# EasyEDA Pro project Arduino.eprj

# Schematic Ardunio nano
Create Date: 2023-09-14; Page Name: P1; Project Name: Arduino; Schematic Name: Ardunio nano; Update Date: 2023-09-15; Company: Joshua Ifeanyi Okonkwo; Drawed: EasyEDA Pro; Page Size: A4; Part Number: JLCPCB-002; Reviewed: EasyEDA Pro; Version: V0.1
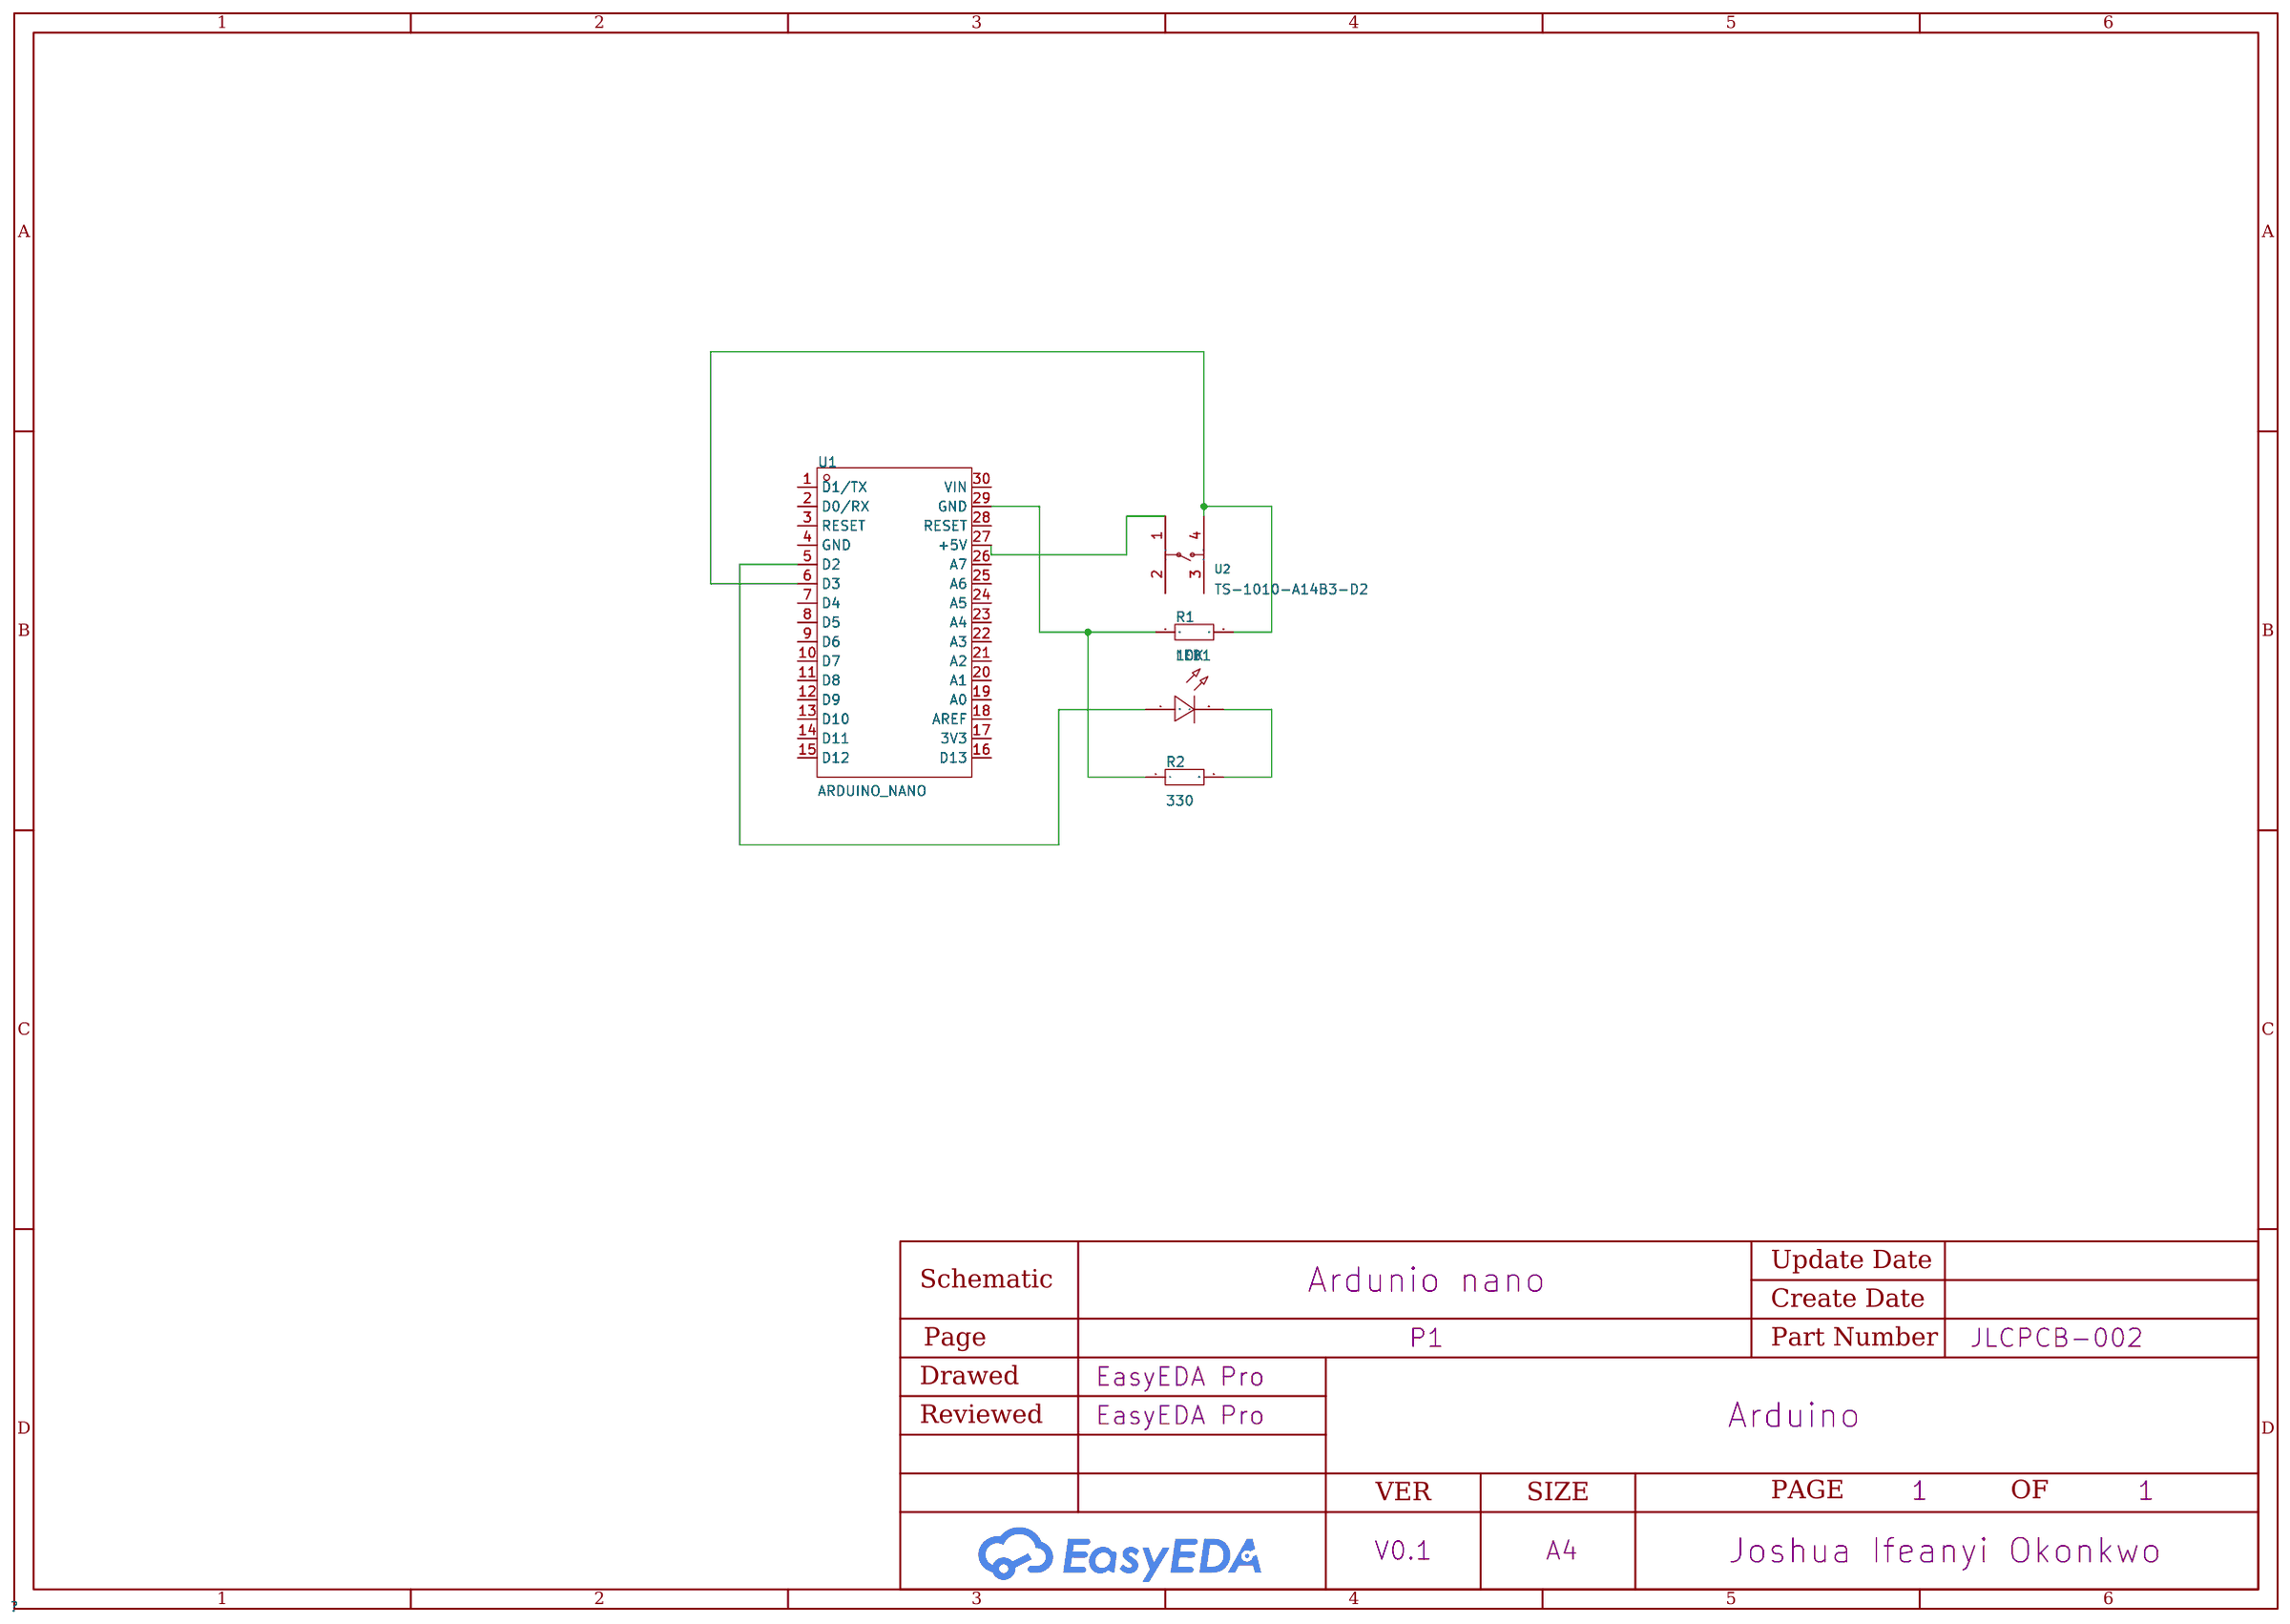
[diagram p0: schematic sheet]

## Parts
LED1  -  [LED-TH_BD3.0-P2.54-FD]
R1  10K  [R0603]
R2  330  [R0603]
U1  ARDUINO_NANO  [COMM-TH_ARDUINO_NANO]
U2  TS-1010-A14B3-D2  [SW-TH_4P-L6.2-W6.2-P4.50-LS6.5]

## Library data of the parts
LED1 = LED_TH-R_3mm: Supplier Footprint: Through
R1 R2 = Res_0603: Supplier Footprint: 0603
U1 = ARDUINO_NANO: Supplier Part: C9900017879; Supplier Footprint: 插件; JLCPCB Part Class: Extended Part; Datasheet: https://atta.szlcsc.comnull; Supplier: LCSC
U2 = TS-1010-A14B3-D2: LCSC Part Name: 防水插件轻触开关6.2*6.2*11四脚插件6*6*11插件IP67按键250gf; Supplier Part: C585183; Manufacturer: Yuandi(元迪); Supplier Footprint: 插件,6.2x6.2mm; JLCPCB Part Class: Extended Part; Datasheet: https://atta.szlcsc.com/upload/public/pdf/source/20230412/8C4FF65CF1BB4088A9FBFCD80E83B7A4.pdf; Supplier: LCSC

## Nets
$1N1786: U1.27(+5V) U2.1
$1N1790: R1.2 U1.6(D3) U2.4
$1N1825: LED1.1(C) U1.5(D2)
$1N1840: LED1.2(A) R2.2
$1N1849: R1.1 R2.1 U1.29(GND)

Not connected (* = marked no-connect by the designer): U1 1(D1/TX) 2(D0/RX) 3(RESET) 4(GND) 7(D4) 8(D5) 9(D6) 10(D7) 11(D8) 12(D9) 13(D10) 14(D11) 15(D12) 16(D13) 17(3V3) 18(AREF) 19(A0) 20(A1) 21(A2) 22(A3) 23(A4) 24(A5) 25(A6) 26(A7) 28(RESET) 30(VIN); U2 2 3

# Board PCB1
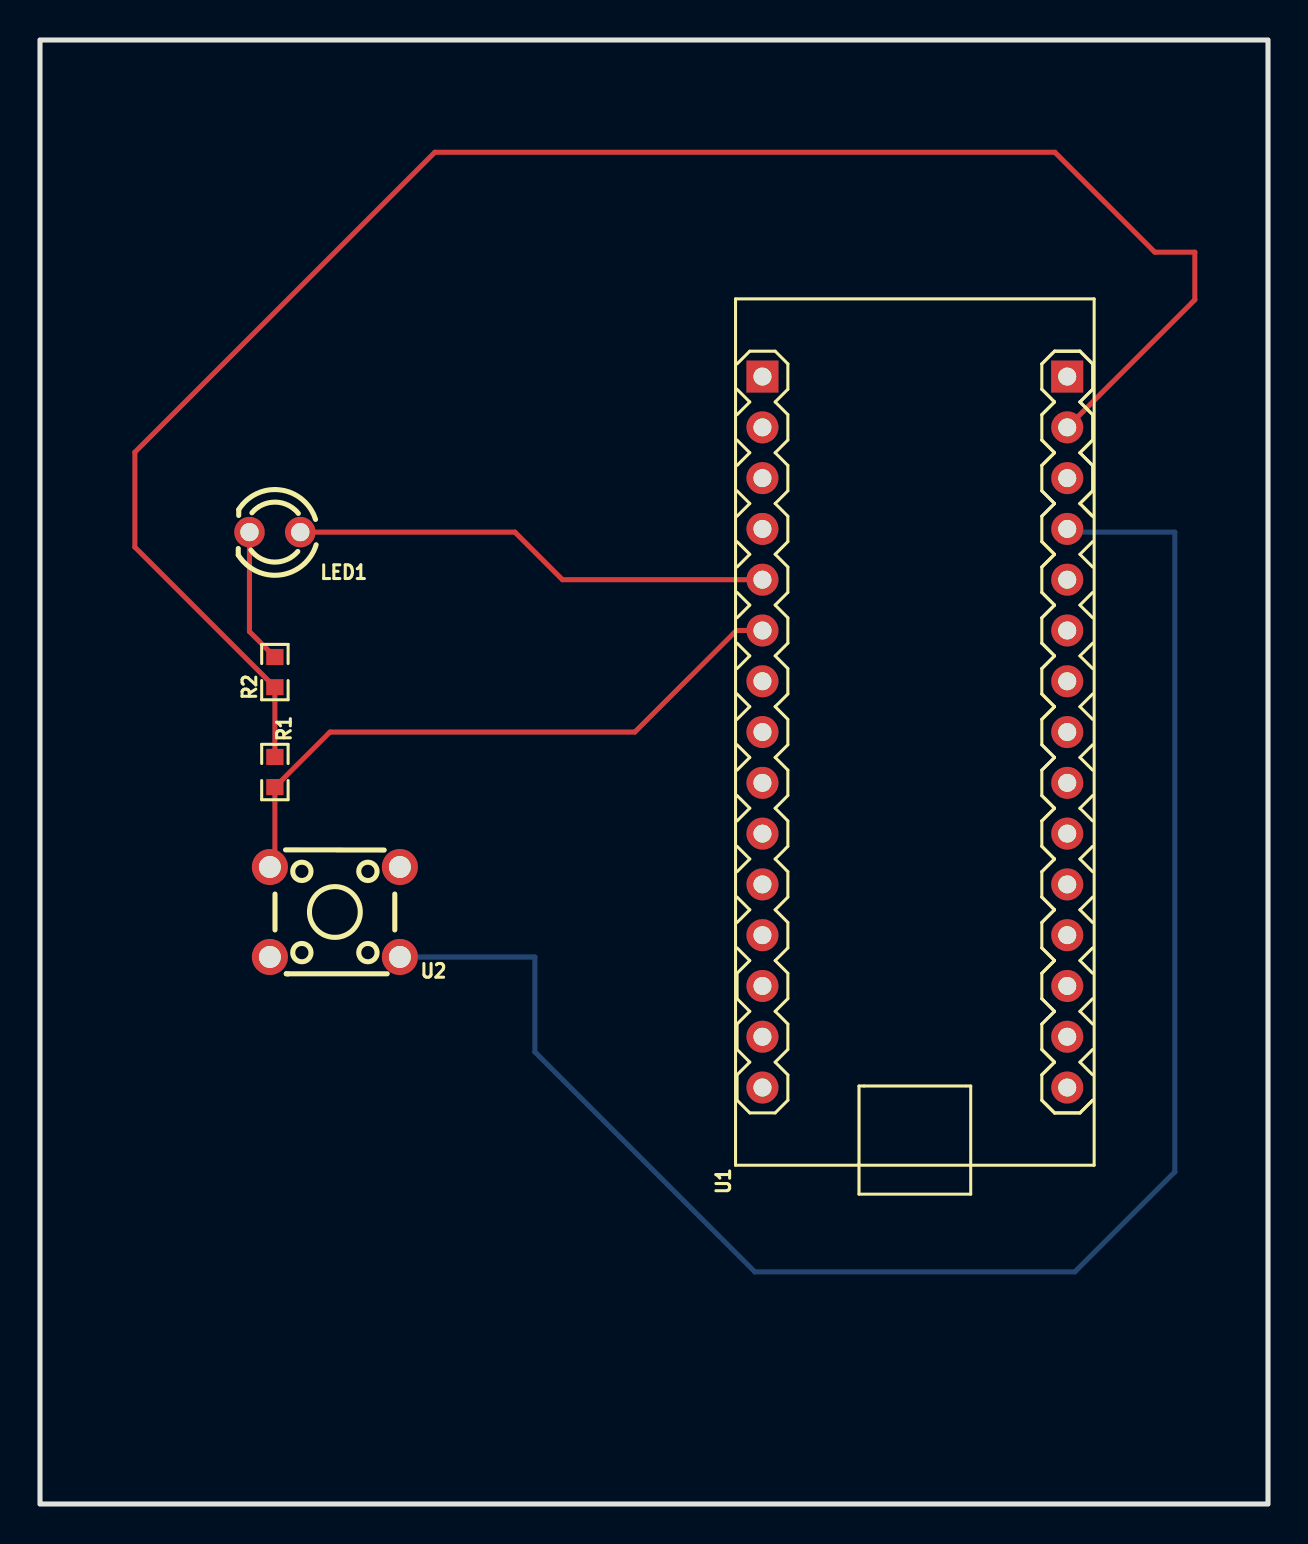
[diagram p1: board, top side]
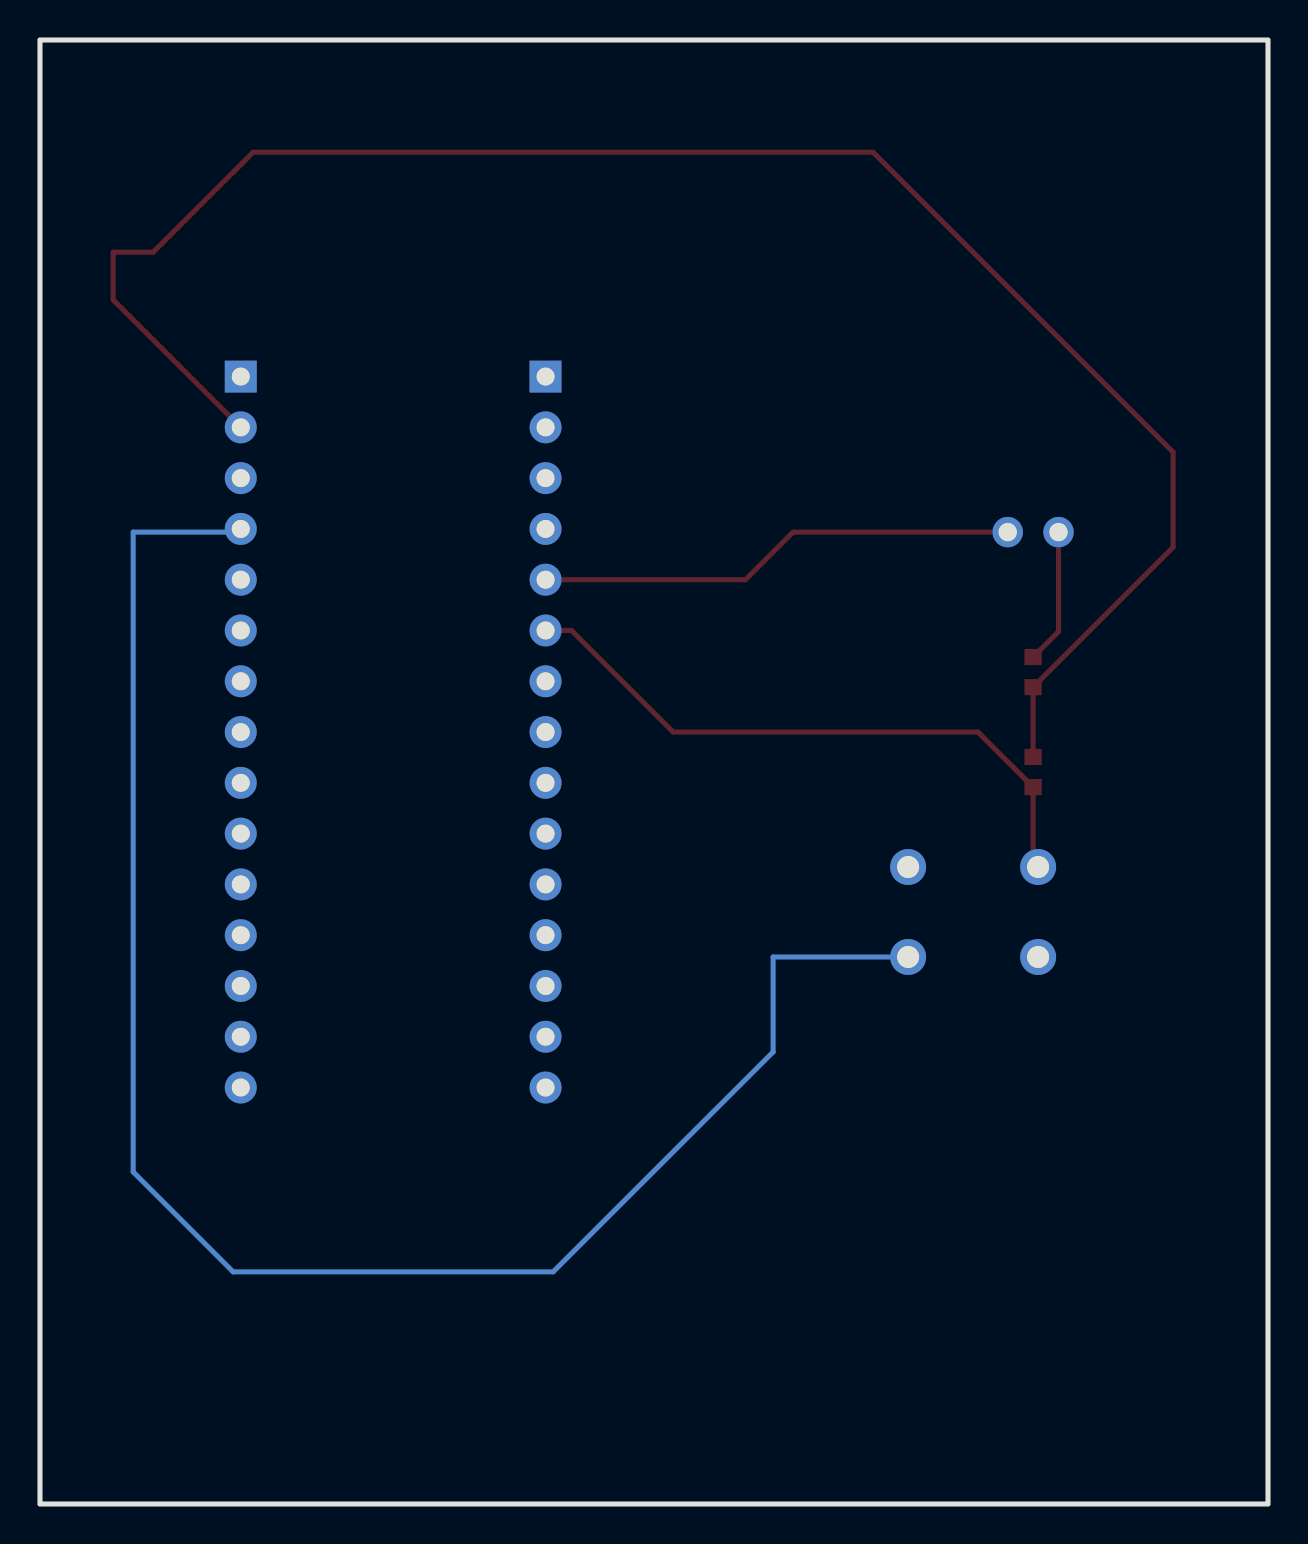
[diagram p2: board, bottom side, seen from below]

Outline 61.4 x 73.23 mm; copper layers: Top Layer, Bottom Layer. Coordinates in mm from the lower left corner of the outline.
Outline path: rectangle 0,73.23 61.4,0
Stack: Top Layer 0.035mm / Dielectric1 1.51mm FR4 er 4.5 / Bottom Layer 0.035mm

## Design rules (mm)
template: JLCPCB Capability(Two Layers Board)
spacing copperThickness1oz (default): track to track 0.102, other pairs 0.152 to 0.3
spacing copperThickness2oz: track to track 0.203, other pairs 0.152 to 0.3
track width copperThickness1oz (default): min 0.127, default 0.254, max 2.54
track width copperThickness2oz: min 0.203, default 0.254, max 2.54
differential pair differentialPair (default): width min 0.127, default 0.254, max 2.54; gap min 0.152, default 0.152
via viaSize (default): diameter min 0.5, default 0.61, max 10; hole min 0.3, default 0.305, max 6.3

## Placement (name value [footprint] x y rotation side)
LED1  -  [LED-TH_BD3.0-P2.54-FD]  11.75 48.61 180 top
R1  10K  [R0603]  11.75 36.61 270 top
R2  330  [R0603]  11.75 41.61 90 top
U1  ARDUINO_NANO  [COMM-TH_ARDUINO_NANO]  43.75 38.61 90 top
U2  TS-1010-A14B3-D2  [SW-TH_4P-L6.2-W6.2-P4.50-LS6.5]  14.75 29.61 180 top

## Footprints (pads in the part's own frame, mm; a bottom-side part is the same pattern mirrored in y, then rotated)
COMM-TH_ARDUINO_NANO
  rect 1.6x1.6 hole 0.9: 1(17.78,7.62) 30(17.78,-7.62)
  round 1.6 hole 0.9: 2(15.24,7.62) 3(12.7,7.62) 4(10.16,7.62) 5(7.62,7.62) 6(5.08,7.62) 7(2.54,7.62) 8(0,7.62) 9(-2.54,7.62) 10(-5.08,7.62) 11(-7.62,7.62) 12(-10.16,7.62) 13(-12.7,7.62) 14(-15.24,7.62) 15(-17.78,7.62) 16(-17.78,-7.62) 17(-15.24,-7.62) 18(-12.7,-7.62) 19(-10.16,-7.62) 20(-7.62,-7.62) 21(-5.08,-7.62) 22(-2.54,-7.62) 23(0,-7.62) 24(2.54,-7.62) 25(5.08,-7.62) 26(7.62,-7.62) 27(10.16,-7.62) 28(12.7,-7.62) 29(15.24,-7.62)
LED-TH_BD3.0-P2.54-FD
  round 1.524 hole 0.914: 1(-1.27,0) 2(1.27,0)
R0603
  rect 0.806x0.864 smd: 1(-0.753,0) 2(0.753,0)
SW-TH_4P-L6.2-W6.2-P4.50-LS6.5
  round 1.8 hole 1.1: 1(-3.25,2.25) 2(3.25,2.25) 3(-3.25,-2.25) 4(3.25,-2.25)

## Nets
As in the schematic.

Pads without a net: U1 1 2 3 4 7 8 9 10 11 12 13 14 15 16 17 18 19 20 21 22 23 24 25 26 28 30; U2 2 3

## Routing (per net, layer and track width the routed paths; a pad name or vN(x,y) marks a point on that pad's centre or on a via; arc(x,y) is an arc through that point)
$1N1786: length 87.6
  Bottom Layer w0.254: U1.27 51.53,48.61 56.75,48.61 56.75,16.61 51.75,11.61 35.75,11.61 24.75,22.61 24.75,27.36 U2.1
$1N1790: length 31.7
  Top Layer w0.254: U1.6 34.83,43.69 29.75,38.61 14.5,38.61 R1.2 11.75,32.11 U2.4
$1N1825: length 24.1
  Top Layer w0.254: U1.5 26.12,46.23 23.75,48.61 LED1.1
$1N1840: length 6.8
  Top Layer w0.254: R2.2 10.48,43.63 LED1.2
$1N1849: length 90.6
  Top Layer w0.254: U1.29 57.75,60.23 57.75,62.61 55.75,62.61 50.75,67.61 19.75,67.61 4.75,52.61 4.75,47.86 R2.1 11.75,37.61
